# EAGLE design robot (EAGLE 7.5.0)
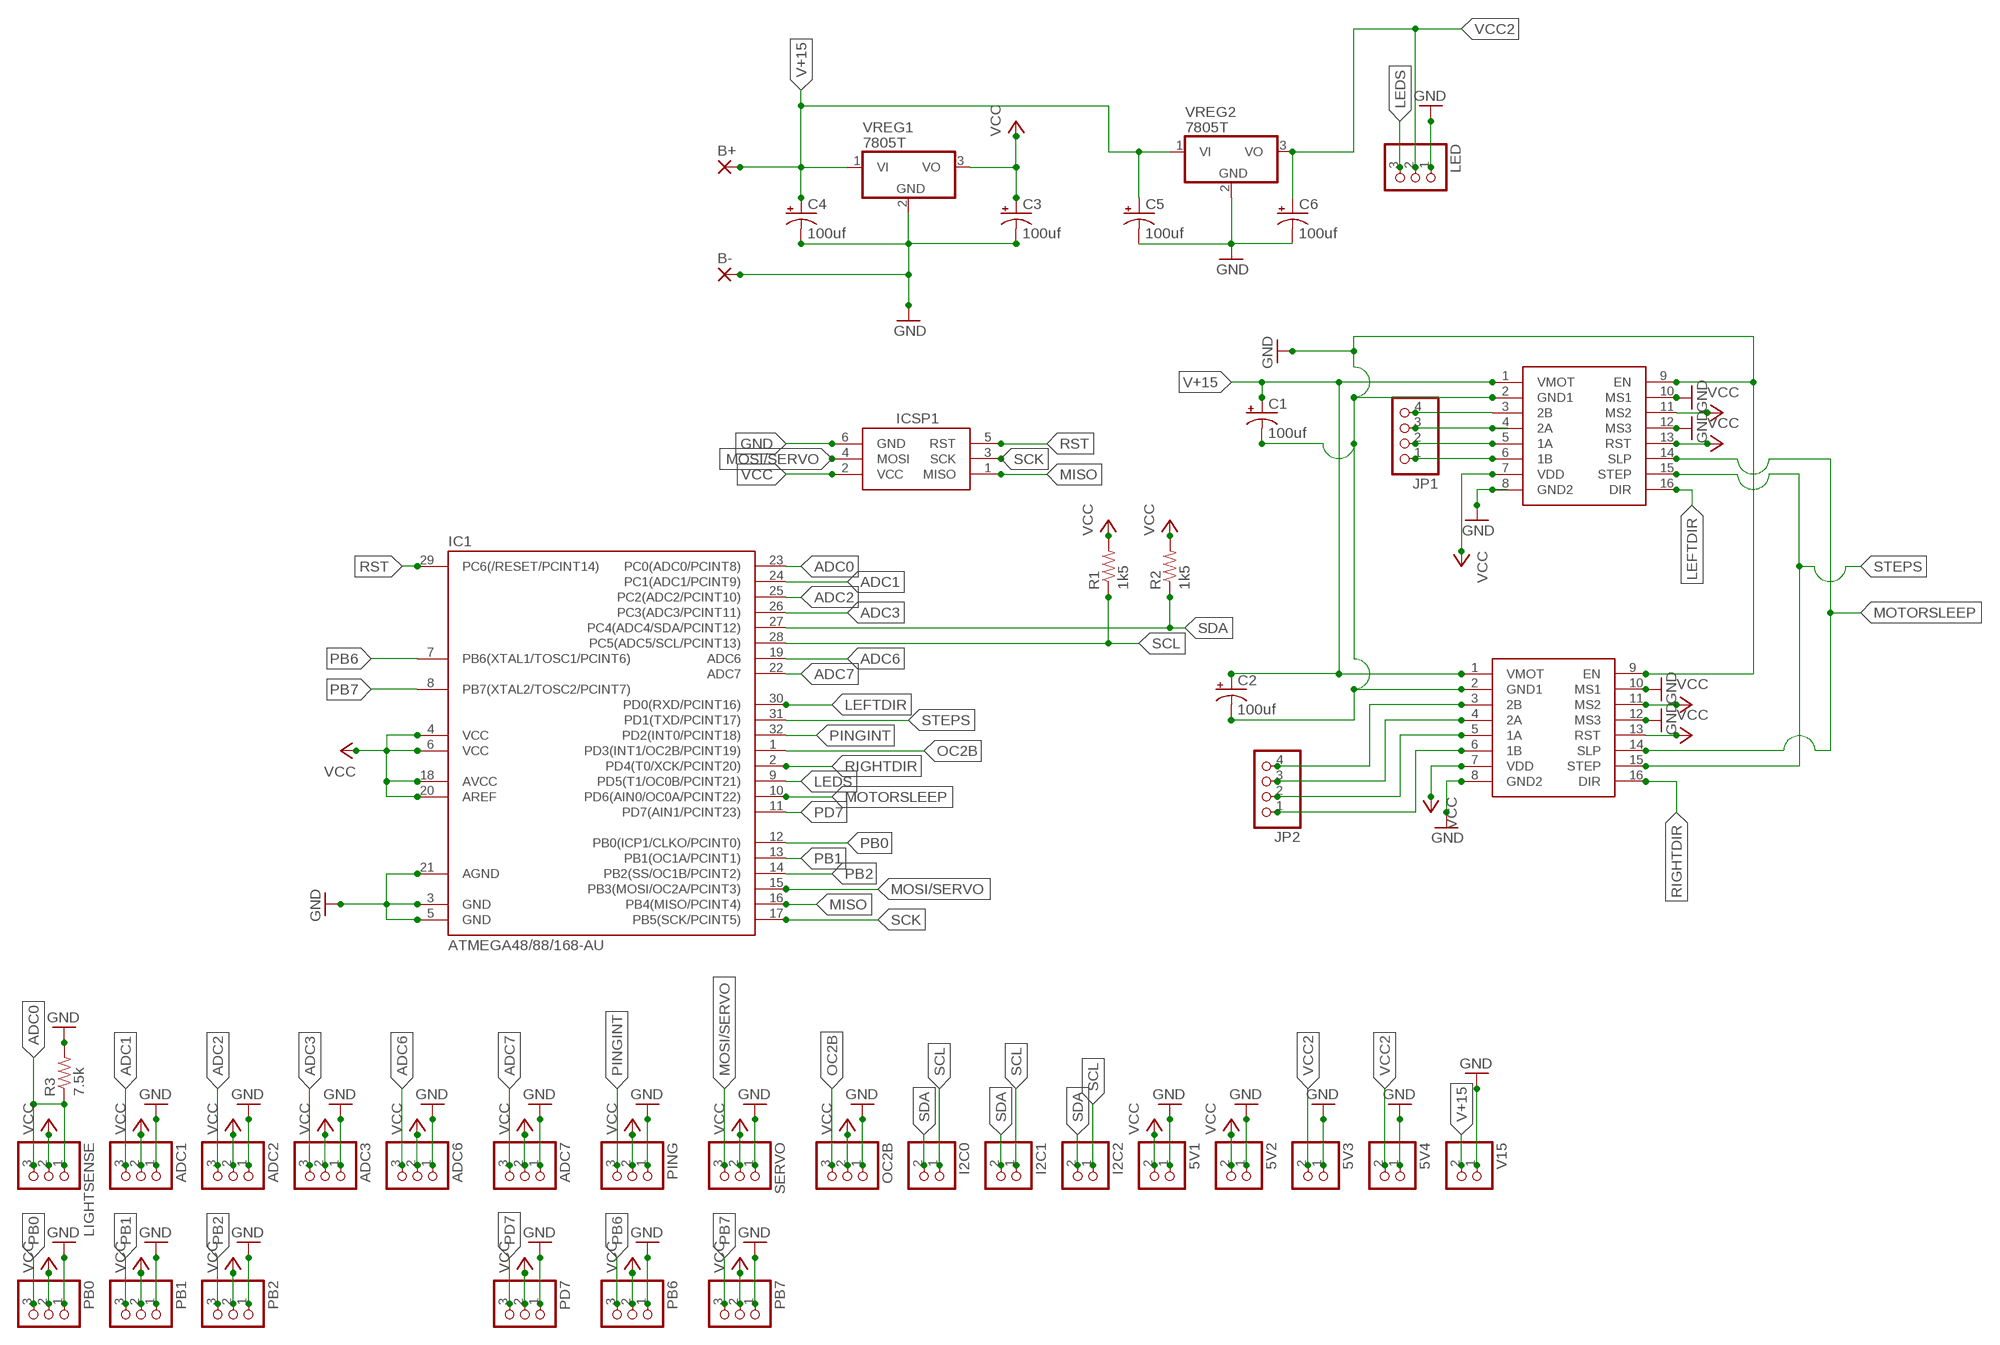
[diagram p0: schematic, sheet 1]

## Parts
5V1  PINHD-1X2  [1X02]
5V2  PINHD-1X2  [1X02]
5V3  PINHD-1X2  [1X02]
5V4  PINHD-1X2  [1X02]
ADC1  PINHD-1X3  [1X03]
ADC2  PINHD-1X3  [1X03]
ADC3  PINHD-1X3  [1X03]
ADC6  PINHD-1X3  [1X03]
ADC7  PINHD-1X3  [1X03]
B+  3,81/1,4  [3,81/1,4]
B-  3,81/1,4  [3,81/1,4]
C1  100uf  CPOL-USE3.5-8  [E3,5-8]
C2  100uf  CPOL-USE3.5-8  [E3,5-8]
C3  100uf  CPOL-USE3.5-8  [E3,5-8]
C4  100uf  CPOL-USE3.5-8  [E3,5-8]
C5  100uf  CPOL-USE3.5-8  [E3,5-8]
C6  100uf  CPOL-USE3.5-8  [E3,5-8]
I2C0  PINHD-1X2  [1X02]
I2C1  PINHD-1X2  [1X02]
I2C2  PINHD-1X2  [1X02]
IC1  ATMEGA48/88/168-AU  [TQFP32-08]
ICSP1  AVRISP-6  [AVRISP]
JP1  PINHD-1X4  [1X04]
JP2  PINHD-1X4  [1X04]
LED  PINHD-1X3  [1X03]
LEFTSTEPPER  POLOLUESTEPPERDRIVER  [DIL16]
LIGHTSENSE  PINHD-1X3  [1X03]
OC2B  PINHD-1X3  [1X03]
PB0  PINHD-1X3  [1X03]
PB1  PINHD-1X3  [1X03]
PB2  PINHD-1X3  [1X03]
PB6  PINHD-1X3  [1X03]
PB7  PINHD-1X3  [1X03]
PD7  PINHD-1X3  [1X03]
PING  PINHD-1X3  [1X03]
R1  1k5  R-US_M1206  [M1206]
R2  1k5  R-US_M1206  [M1206]
R3  7.5k  R-US_0309/10  [0309/10]
RIGHTSTEPPER  POLOLUESTEPPERDRIVER  [DIL16]
SERVO  PINHD-1X3  [1X03]
V15  PINHD-1X2  [1X02]
VREG1  7805T  [TO220H]
VREG2  7805T  [TO220H]

## Nets
1-1A: JP1.2 LEFTSTEPPER.5(1A)
1-1B: JP1.1 LEFTSTEPPER.6(1B)
1-2A: JP1.3 LEFTSTEPPER.4(2A)
1-2B: JP1.4 LEFTSTEPPER.3(2B)
2-1A: JP2.2 RIGHTSTEPPER.5(1A)
2-1B: JP2.1 RIGHTSTEPPER.6(1B)
2-2A: JP2.3 RIGHTSTEPPER.4(2A)
2-2B: JP2.4 RIGHTSTEPPER.3(2B)
ADC0: IC1.23(PC0(ADC0/PCINT8)) LIGHTSENSE.1 LIGHTSENSE.3 R3.1
ADC1: ADC1.3 IC1.24(PC1(ADC1/PCINT9))
ADC2: ADC2.3 IC1.25(PC2(ADC2/PCINT10))
ADC3: ADC3.3 IC1.26(PC3(ADC3/PCINT11))
ADC6: ADC6.3 IC1.19(ADC6)
ADC7: ADC7.3 IC1.22(ADC7)
GND: 5V1.1 5V2.1 5V3.1 5V4.1 ADC1.1 ADC2.1 ADC3.1 ADC6.1 ADC7.1 B-.1(P) C1.- C2.- C3.- C4.- C5.- C6.- IC1.3(GND) IC1.5(GND) IC1.21(AGND) ICSP1.6(GND) LED.1 LEFTSTEPPER.2(GND1) LEFTSTEPPER.8(GND2) LEFTSTEPPER.9(EN) LEFTSTEPPER.10(MS1) LEFTSTEPPER.12(MS3) OC2B.1 PB0.1 PB1.1 PB2.1 PB6.1 PB7.1 PD7.1 PING.1 R3.2 RIGHTSTEPPER.2(GND1) RIGHTSTEPPER.8(GND2) RIGHTSTEPPER.9(EN) RIGHTSTEPPER.10(MS1) RIGHTSTEPPER.12(MS3) SERVO.1 V15.1 VREG1.2(GND) VREG2.2(GND)
LEDS: IC1.9(PD5(T1/OC0B/PCINT21)) LED.3
LEFTDIR: IC1.30(PD0(RXD/PCINT16)) LEFTSTEPPER.16(DIR)
MISO: IC1.16(PB4(MISO/PCINT4)) ICSP1.1(MISO)
MOSI/SERVO: IC1.15(PB3(MOSI/OC2A/PCINT3)) ICSP1.4(MOSI) SERVO.3
MOTORSLEEP: IC1.10(PD6(AIN0/OC0A/PCINT22)) LEFTSTEPPER.14(SLP) RIGHTSTEPPER.14(SLP)
OC2B: IC1.1(PD3(INT1/OC2B/PCINT19)) OC2B.3
PB0: IC1.12(PB0(ICP1/CLKO/PCINT0)) PB0.3
PB1: IC1.13(PB1(OC1A/PCINT1)) PB1.3
PB2: IC1.14(PB2(SS/OC1B/PCINT2)) PB2.3
PB6: IC1.7(PB6(XTAL1/TOSC1/PCINT6)) PB6.3
PB7: IC1.8(PB7(XTAL2/TOSC2/PCINT7)) PB7.3
PD7: IC1.11(PD7(AIN1/PCINT23)) PD7.3
PINGINT: IC1.32(PD2(INT0/PCINT18)) PING.3
RIGHTDIR: IC1.2(PD4(T0/XCK/PCINT20)) RIGHTSTEPPER.16(DIR)
RST: IC1.29(PC6(/RESET/PCINT14)) ICSP1.5(RST)
SCK: IC1.17(PB5(SCK/PCINT5)) ICSP1.3(SCK)
SCL: I2C0.1 I2C1.1 I2C2.1 IC1.28(PC5(ADC5/SCL/PCINT13)) R1.1
SDA: I2C0.2 I2C1.2 I2C2.2 IC1.27(PC4(ADC4/SDA/PCINT12)) R2.1
STEPS: IC1.31(PD1(TXD/PCINT17)) LEFTSTEPPER.15(STEP) RIGHTSTEPPER.15(STEP)
V+15: B+.1(P) C1.+ C2.+ C4.+ C5.+ LEFTSTEPPER.1(VMOT) RIGHTSTEPPER.1(VMOT) V15.2 VREG1.1(VI) VREG2.1(VI)
VCC: 5V1.2 5V2.2 ADC1.2 ADC2.2 ADC3.2 ADC6.2 ADC7.2 C3.+ IC1.4(VCC) IC1.6(VCC) IC1.18(AVCC) IC1.20(AREF) ICSP1.2(VCC) LEFTSTEPPER.7(VDD) LEFTSTEPPER.11(MS2) LEFTSTEPPER.13(RST) LIGHTSENSE.2 OC2B.2 PB0.2 PB1.2 PB2.2 PB6.2 PB7.2 PD7.2 PING.2 R1.2 R2.2 RIGHTSTEPPER.7(VDD) RIGHTSTEPPER.11(MS2) RIGHTSTEPPER.13(RST) SERVO.2 VREG1.3(VO)
VCC2: 5V3.2 5V4.2 C6.+ LED.2 VREG2.3(VO)

## Library data of the parts
5V1-5V4 I2C0 I2C1 I2C2 V15 = pinhead:PINHD-1X2: PIN HEADER
ADC1-ADC3 ADC6 ADC7 LED LIGHTSENSE OC2B PB0 PB1 PB2 PB6 PB7 PD7 PING SERVO = pinhead:PINHD-1X3: PIN HEADER
B+ B- = wirepad:3,81/1,4: THROUGH-HOLE PAD
C1-C6 = rcl:CPOL-US: POLARIZED CAPACITOR, American symbol
IC1 = atmega8:ATMEGA48/88/168
ICSP1 = adafruit:AVRISP: AVR ISP HEADER Standard 6 pin header for AVR programming
JP1 JP2 = pinhead:PINHD-1X4: PIN HEADER
LEFTSTEPPER RIGHTSTEPPER = reprap:POLOLUESTEPPERDRIVER: Pololu stepper driver based on the A4983.
R1-R3 = resistor:R-US_: RESISTOR, American symbol
VREG1 VREG2 = linear:78*: Positive VOLTAGE REGULATOR Source: http://cache.national.com/ds/LM/LM78L05.pdf http://www.fairchildsemi.com/ds/LM/LM7805.pdf

## Net classes
0 default: clearance 0.205 mm

## Board
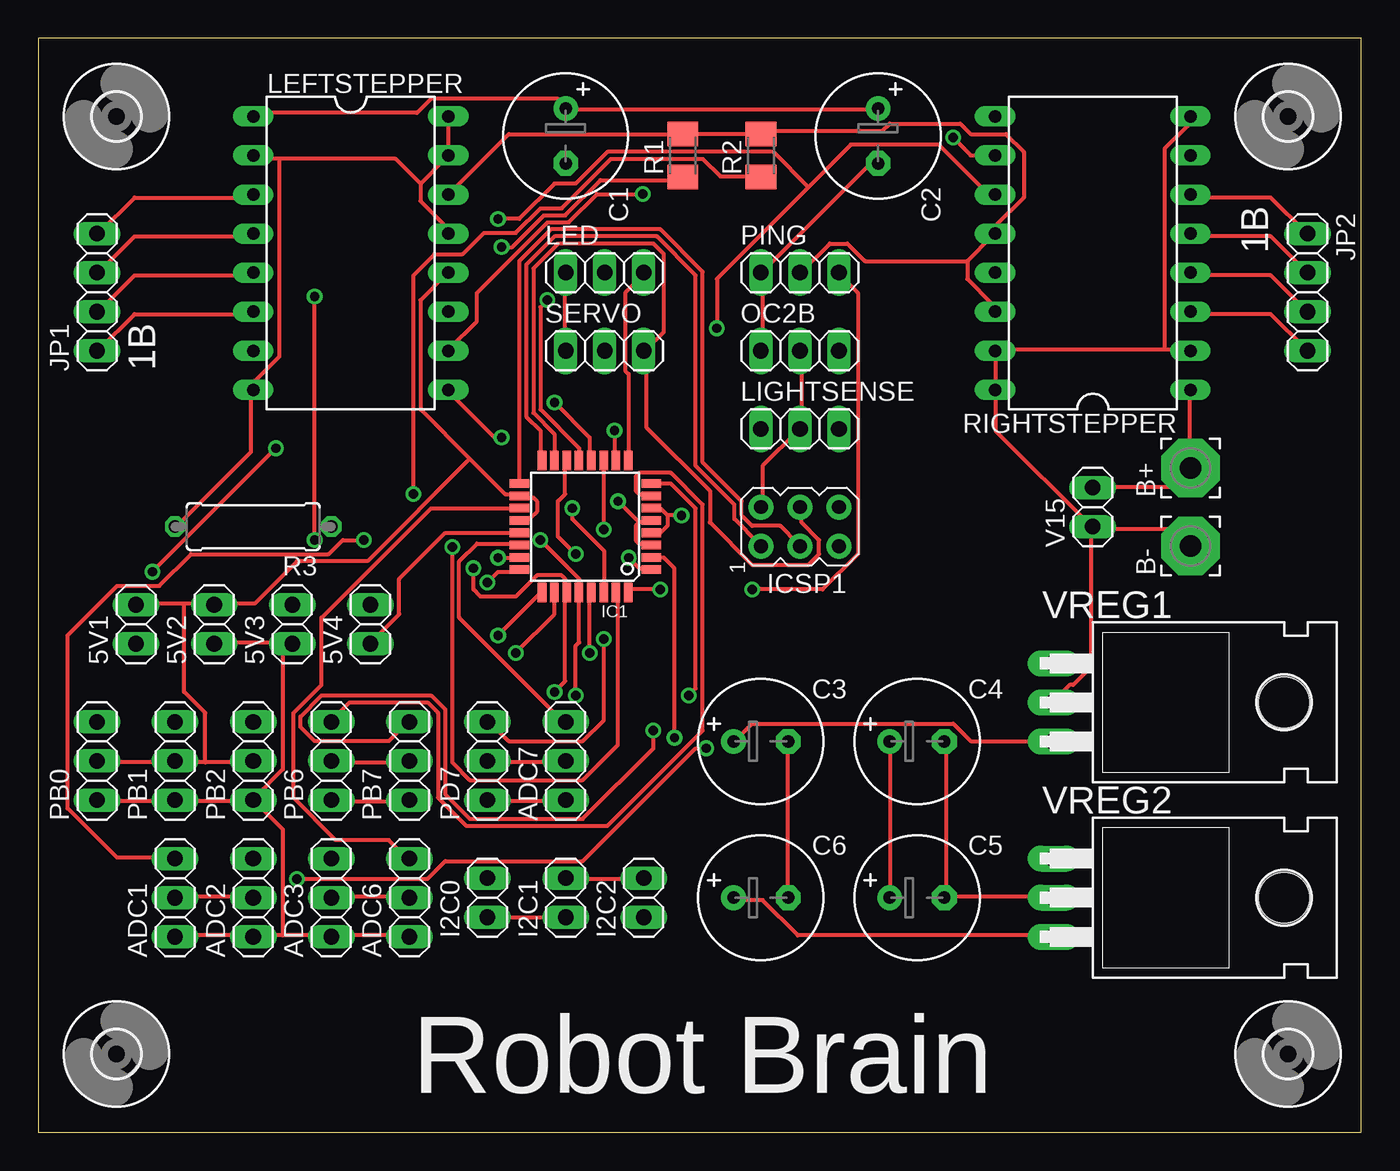
[diagram p1: board, top side]
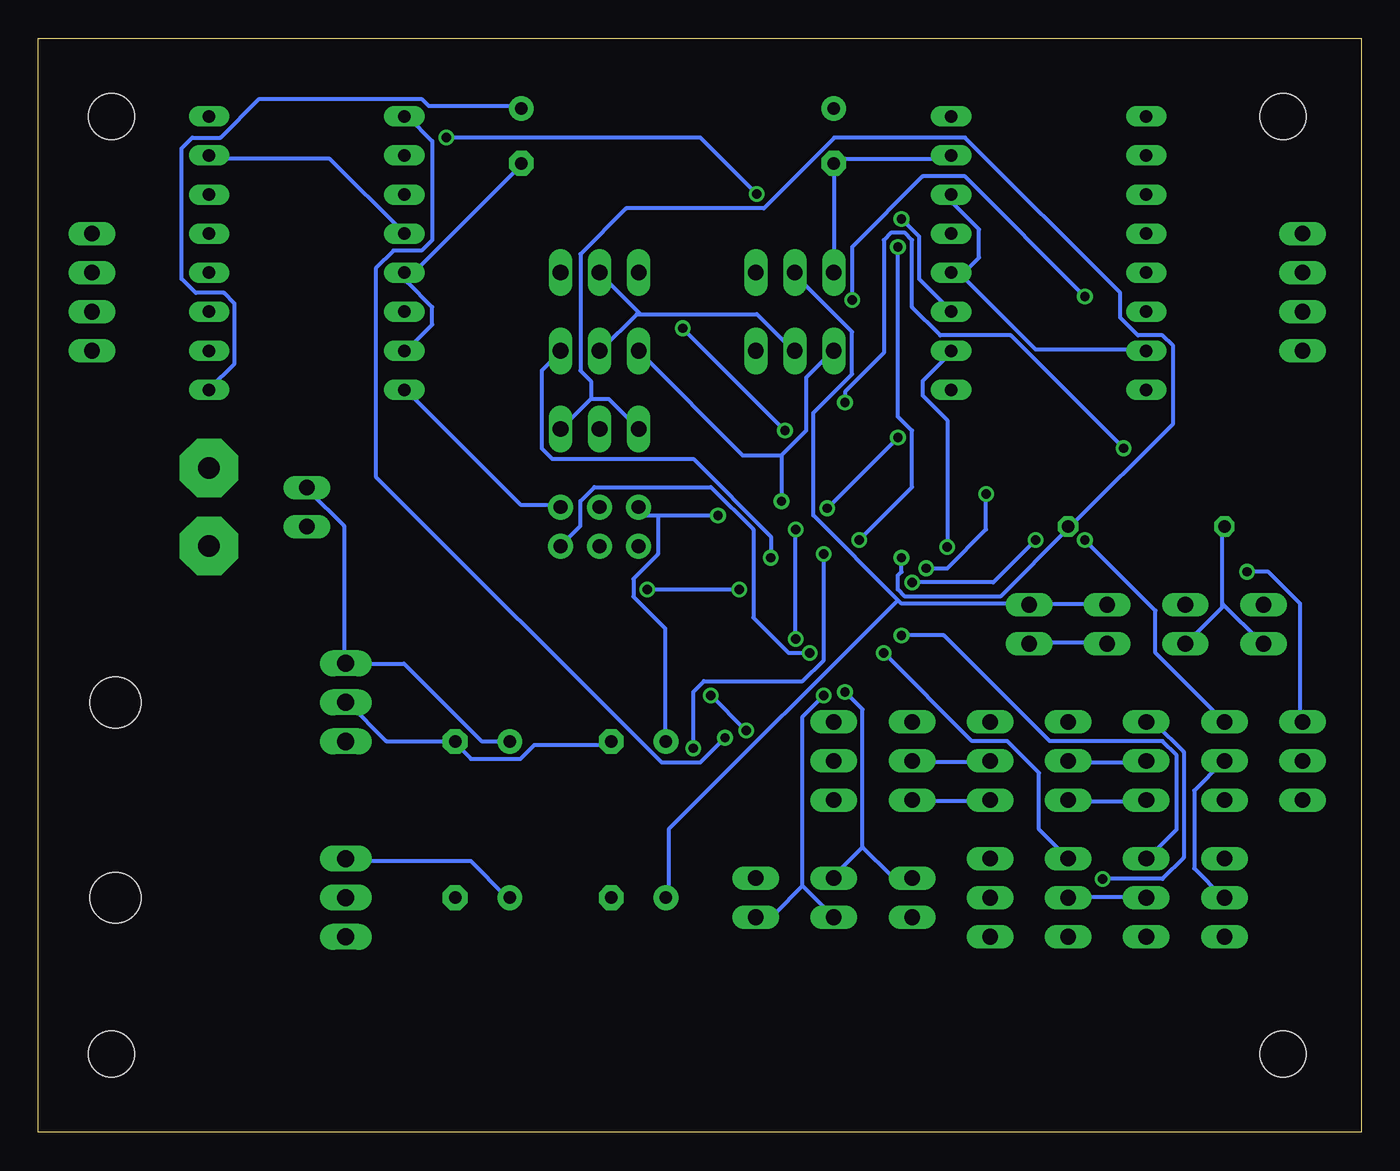
[diagram p2: board, bottom side, seen from below]

Size 86.03 x 71.11 mm. Coordinates in mm from the lower left corner, seen from the top.
Outline: 0,0 86.03,0 86.03,71.11 0,71.11 0,0
Copper layers (1*16): Top 0.035mm / dielectric 1.5mm / Bottom 0.035mm
Design rules "default": minimum track width 10mil, minimum drill 24mil, track to track 8mil, track to pad 8mil, pad to pad 8mil, via to via 8mil, smd to smd 8mil, copper to edge 40mil, drill to drill 8mil, minimum pad ring 10mil, minimum via ring 8mil, stop-mask expansion 4mil, vias tented up to drill 0mil, thermal gap 10mil

### Footprints (pad centres in the part's own frame; a part is rotated, then mirrored left to right if it is on the bottom)
1X02 = drill 1.016 long: 1 -1.27,0; 2 1.27,0
1X03 = drill 1.016 long: 1 -2.54,0; 2 0,0; 3 2.54,0
3,81/1,4 = drill 1.397 pad 3.81 octagon: 1 0,0
E3,5-8 = drill 0.813 pad 1.6: + -1.778,0 | drill 0.813 pad 1.6 octagon: - 1.778,0
TQFP32-08 = smd 1.27 x 0.559: 1 -4.293,2.8; 2 -4.293,2; 3 -4.293,1.2; 4 -4.293,0.4; 5 -4.293,-0.4; 6 -4.293,-1.2; 7 -4.293,-2; 8 -4.293,-2.8; 17 4.293,-2.8; 18 4.293,-2; 19 4.293,-1.2; 20 4.293,-0.4; 21 4.293,0.4; 22 4.293,1.2; 23 4.293,2; 24 4.293,2.8 | smd 0.559 x 1.27: 9 -2.8,-4.293; 10 -2,-4.293; 11 -1.2,-4.293; 12 -0.4,-4.293; 13 0.4,-4.293; 14 1.2,-4.293; 15 2,-4.293; 16 2.8,-4.293; 25 2.8,4.293; 26 2,4.293; 27 1.2,4.293; 28 0.4,4.293; 29 -0.4,4.293; 30 -1.2,4.293; 31 -2,4.293; 32 -2.8,4.293
AVRISP = drill 0.9 pad 1.626: 1 -1.27,2.54; 2 1.27,2.54; 3 -1.27,0; 4 1.27,0; 5 -1.27,-2.54; 6 1.27,-2.54
1X04 = drill 1.016 long: 1 -3.81,0; 2 -1.27,0; 3 1.27,0; 4 3.81,0
DIL16 = drill 0.813 long: 1 -17.78,8.89; 2 -17.78,6.35; 3 -17.78,3.81; 4 -17.78,1.27; 5 -17.78,-1.27; 6 -17.78,-3.81; 7 -17.78,-6.35; 8 -17.78,-8.89; 9 -5.08,8.89; 10 -5.08,6.35; 11 -5.08,3.81; 12 -5.08,1.27; 13 -5.08,-1.27; 14 -5.08,-3.81; 15 -5.08,-6.35; 16 -5.08,-8.89
M1206 = smd 1.6 x 2: 1 -1.4,0; 2 1.4,0
0309/10 = drill 0.813 octagon: 1 -5.08,0; 2 5.08,0
3,0 = hole 3: 0,0
TO220H = drill 1.118 long: 1 -2.54,-10.16; 2 0,-10.16; 3 2.54,-10.16 | hole 3.302: 0,4.826

### Placement (x,y rotation side)
5V1  6.35,33.02 90 top
5V2  11.43,33.02 90 top
5V3  16.51,33.02 90 top
5V4  21.59,33.02 90 top
ADC1  8.89,15.24 90 top
ADC2  13.97,15.24 90 top
ADC3  19.05,15.24 90 top
ADC6  24.13,15.24 90 top
ADC7  34.29,24.13 90 top
B+  74.93,43.18 90 top
B-  74.93,38.1 90 top
C1  34.29,64.77 270 top
C2  54.61,64.77 270 top
C3  46.99,25.4 0 top
C4  57.15,25.4 0 top
C5  57.15,15.24 0 top
C6  46.99,15.24 0 top
I2C0  29.21,15.24 90 top
I2C1  34.29,15.24 90 top
I2C2  39.37,15.24 90 top
IC1  35.56,39.37 180 top
ICSP1  49.53,39.37 90 top
JP1  3.81,54.61 90 top
JP2  82.55,54.61 270 top
LED  36.83,55.88 0 top
LEFTSTEPPER  31.75,57.15 0 top
LIGHTSENSE  49.53,45.72 0 top
OC2B  49.53,50.8 0 top
PB0  3.81,24.13 90 top
PB1  8.89,24.13 90 top
PB2  13.97,24.13 90 top
PB6  19.05,24.13 90 top
PB7  24.13,24.13 90 top
PD7  29.21,24.13 90 top
PING  49.53,55.88 0 top
R1  41.91,63.5 90 top
R2  46.99,63.5 90 top
R3  13.97,39.37 180 top
RIGHTSTEPPER  57.15,57.15 180 top
SERVO  36.83,50.8 0 top
U$1  [3,0]  81.28,5.08 0 top
U$2  [3,0]  5.08,5.08 0 top
U$3  [3,0]  5.08,66.04 0 top
U$4  [3,0]  81.28,66.04 0 top
V15  68.58,40.64 90 top
VREG1  76.2,27.94 270 top
VREG2  76.2,15.24 270 top

### Tracks (layer width: path | path; a pad name or v marks a point on that pad's centre or on a via)
1-1A
  Top 0.254: LEFTSTEPPER.5 13.83,55.71 6.26,55.71 3.96,53.41 JP1.2
1-1B
  Top 0.254: LEFTSTEPPER.6 13.83,53.18 6.26,53.18 3.96,50.89 JP1.1
1-2A
  Top 0.254: LEFTSTEPPER.4 13.83,58.23 6.26,58.23 3.96,55.94 JP1.3
1-2B
  Top 0.254: LEFTSTEPPER.3 13.83,60.76 6.26,60.76 3.96,58.46 JP1.4
2-1A
  Top 0.254: RIGHTSTEPPER.5 75.11,58.23 80.16,58.23 82.45,55.94 JP2.2
2-1B
  Top 0.254: RIGHTSTEPPER.6 75.11,60.76 80.16,60.76 82.45,58.46 JP2.1
2-2A
  Top 0.254: RIGHTSTEPPER.4 75.11,55.71 80.16,55.71 82.45,53.41 JP2.3
2-2B
  Top 0.254: RIGHTSTEPPER.3 75.11,53.18 80.16,53.18 82.45,50.89 JP2.4
ADC0  (via drill 0.61)
  Top 0.254: v29.89,37.35 31.04,37.35 IC1.23
  Bottom 0.254: 50.09,47.67 48.94,47.67 47.11,45.84 LIGHTSENSE.1 | 50.09,47.67 51.93,45.84 LIGHTSENSE.3 | v29.89,37.35 29.89,36.43 30.12,36.2 30.12,35.28 29.67,34.82 23.47,34.82 19.11,39.18 R3.1 18.88,39.41 12.22,46.07 12.22,51.12 12.91,51.81 14.52,51.81 15.67,52.95 15.67,54.56 25.76,64.66 34.26,64.66 38.85,60.07 47.8,60.07 50.78,57.09 50.78,49.51 50.09,48.82 50.09,47.67
ADC1  (via drill 0.61)
  Top 0.254: v29.21,35.74 29.89,36.43 31.04,36.43 IC1.24 | v21.17,38.5 19.8,38.5 18.88,37.58 9.93,37.58 7.86,35.51 5.11,35.51 1.9,32.3 1.9,21.05 5.11,17.84 8.78,17.84 ADC1.3
  Bottom 0.254: v29.21,35.74 23.93,35.74 v21.17,38.5
ADC2  (via drill 0.61)
  Top 0.254: v29.89,32.3 32.65,35.05 IC1.25
  Bottom 0.254: v29.89,32.3 27.14,32.3 20.26,25.41 12.91,25.41 11.99,24.5 11.99,19.68 13.83,17.84 ADC2.3
ADC3  (via drill 0.61)
  Top 0.254: v31.04,31.15 33.57,33.68 33.57,35.05 IC1.26
  Bottom 0.254: v31.04,31.15 25.31,25.41 23.01,25.41 20.95,23.35 20.95,19.68 19.11,17.84 ADC3.3
ADC6
  Top 0.254: IC1.19 31.04,40.56 25.53,40.56 18.42,33.45 18.42,29.09 16.58,27.25 16.58,21.74 19.34,18.99 22.78,18.99 23.93,17.84 ADC6.3
ADC7
  Top 0.254: IC1.22 31.04,38.27 28.52,38.27 27.37,37.12 27.37,33.45 34.26,26.56 ADC7.3
GND  (via drill 0.61)
  Top 0.254: ADC1.1 9.01,12.79 13.83,12.79 ADC2.1 14.06,12.79 15.9,12.79 | ADC6.1 23.93,12.79 19.11,12.79 ADC3.1 18.88,12.79 15.9,12.79 | PD7.1 29.44,21.51 34.26,21.51 ADC7.1 | PB0.1 3.96,21.51 8.78,21.51 PB1.1 9.01,21.51 13.83,21.51 PB2.1 | PB7.1 23.93,21.51 19.11,21.51 PB6.1 | 15.9,12.79 15.9,19.68 14.06,21.51 PB2.1 | IC1.21 31.04,38.95 26.45,38.95 23.47,35.97 23.47,33.68 21.63,31.84 5V4.1 | R3.2 9.01,39.41 13.83,44.23 13.83,48.13 LEFTSTEPPER.8 14.06,48.36 14.06,48.82 15.67,50.43 15.67,63.28 | 15.9,31.84 11.54,31.84 5V2.1 | 15.9,31.84 16.36,31.84 5V3.1 15.9,31.84 | 15.9,31.84 15.9,23.58 14.06,21.74 PB2.1 | 24.85,61.67 24.85,60.53 26.45,58.92 26.45,58.46 LEFTSTEPPER.12 | 24.85,61.67 26.45,63.28 LEFTSTEPPER.10 26.68,63.51 26.68,66.03 LEFTSTEPPER.9 | 15.67,63.28 23.24,63.28 24.85,61.67 | 15.67,63.28 14.06,63.28 LEFTSTEPPER.2 | 39.08,39.64 38.85,39.41 38.85,38.5 39.08,38.27 39.76,38.27 IC1.3 | 39.08,39.64 39.76,39.64 IC1.5 | v37.7,41.02 39.08,39.64 | LED.1 34.26,55.71 34.26,50.89 SERVO.1 | C6.- 48.71,15.32 48.71,25.18 C3.- | 59.04,15.32 65.93,15.32 VREG2.2 | 59.04,15.32 59.04,25.18 C4.- | 59.04,15.32 C5.- | OC2B.1 47.11,50.89 47.11,55.71 PING.1 47.11,55.94 53.99,62.82 54.45,62.82 C2.- | V15.1 68.68,39.18 73.96,39.18 74.88,38.27 B-.1 | 73.27,50.89 62.25,50.89 RIGHTSTEPPER.10 62.25,50.66 62.25,48.36 RIGHTSTEPPER.9 62.25,48.13 62.25,45.61 68.45,39.41 V15.1 | 73.27,50.89 74.88,50.89 RIGHTSTEPPER.2 | 73.27,50.89 73.27,63.97 74.88,65.58 74.88,66.03 RIGHTSTEPPER.8 | VREG1.2 66.16,28.17 67.08,29.09 67.3,29.09 68.45,30.23 68.45,39.18 V15.1
  Bottom 0.254: PB2.1 14.06,21.51 18.88,21.51 PB6.1 | PD7.1 29.21,21.51 24.16,21.51 PB7.1 | 5V3.1 16.58,31.84 21.4,31.84 5V4.1 | 9.01,34.36 9.01,34.14 11.31,31.84 5V2.1 | 9.01,34.36 9.01,39.18 R3.2 | 9.01,34.36 6.49,31.84 5V1.1 | 37.7,44 v37.7,41.02 | 37.7,44 36.09,45.61 36.09,49.05 34.49,50.66 SERVO.1 | LED.1 34.26,55.94 34.26,62.82 C1.- 34.26,63.05 34.03,63.28 26.68,63.28 LEFTSTEPPER.10 | VREG1.2 65.93,27.94 63.4,25.41 59.04,25.41 C4.- 58.81,25.18 57.89,24.27 54.68,24.27 53.76,25.18 48.94,25.18 C3.- | 62.03,55.48 62.03,55.25 60.42,53.64 60.42,52.49 62.03,50.89 RIGHTSTEPPER.10 | 62.03,55.48 62.03,55.71 RIGHTSTEPPER.12 62.03,55.48 | ICSP1.6 52.16,40.79 54.68,40.79 62.03,48.13 RIGHTSTEPPER.9 | 62.03,55.48 54.68,62.82 C2.- | 37.7,44 40.22,44 46.88,50.66 OC2B.1
LEDS
  Top 0.254: IC1.9 38.39,43.77 38.39,49.28 38.16,49.51 38.16,54.56 39.3,55.71 LED.3
LEFTDIR  (via drill 0.61)
  Top 0.254: v34.71,40.56 34.71,39.87 36.78,37.81 36.78,35.28 IC1.30 | v30.12,45.15 29.67,45.15 26.68,48.13 LEFTSTEPPER.16
  Bottom 0.254: v30.12,45.15 v34.71,40.56
MISO
  Top 0.254: IC1.16 32.65,43.77 32.65,45.61 31.73,46.53 31.73,56.4 33.57,58.23 40.22,58.23 42.75,55.71 42.75,43.31 45.27,40.79 45.27,39.87 46.88,38.27 ICSP1.1
MOSI/SERVO
  Top 0.254: IC1.15 33.57,43.77 33.57,45.38 32.19,46.76 32.19,56.17 33.8,57.77 39.99,57.77 40.68,57.09 40.68,52.04 39.53,50.89 SERVO.3 39.53,50.66 39.53,45.84 43.67,41.71 43.67,39.64 46.42,36.89 50.09,36.89 50.78,37.58 50.78,38.5 49.63,39.64 49.63,40.56 ICSP1.4
MOTORSLEEP  (via drill 0.61)
  Top 0.254: v37.47,45.61 37.47,43.77 IC1.10 | v44.12,52.27 44.12,55.48 50.09,61.45 | 50.09,61.45 52.85,64.2 58.58,64.2 62.03,60.76 RIGHTSTEPPER.14 | v29.89,59.38 31.27,59.38 33.57,61.67 34.94,61.67 37.01,63.74 47.8,63.74 50.09,61.45
  Bottom 0.254: v44.12,52.27 v37.47,45.61 | v29.89,59.38 28.75,58.23 28.75,55.48 26.68,53.41 LEFTSTEPPER.14
OC2B  (via drill 0.61)
  Top 0.254: v38.39,37.35 39.08,36.66 39.76,36.66 IC1.1
  Bottom 0.254: v38.39,37.35 38.39,38.73 43.44,43.77 52.62,43.77 53.3,44.46 53.3,49.51 52.16,50.66 OC2B.3
PB0  (via drill 0.61)
  Top 0.254: v33.57,47.45 35.86,45.15 35.86,43.77 IC1.12 | v7.4,36.43 v15.44,44.46
  Bottom 0.254: v33.57,47.45 33.57,48.13 31.04,50.66 31.04,58 30.58,58.46 29.67,58.46 29.21,58 29.21,53.64 27.37,51.81 22.78,51.81 v15.44,44.46 | v7.4,36.43 6.03,36.43 3.96,34.36 3.96,26.79 PB0.3
PB1  (via drill 0.61)
  Top 0.254: v33.11,54.1 32.65,53.64 32.65,46.99 35.17,44.46 35.17,43.77 IC1.13 | v17.96,38.5 v17.96,54.33
  Bottom 0.254: v33.11,54.1 33.11,57.54 28.52,62.13 25.76,62.13 v17.96,54.33 | v17.96,38.5 13.37,33.91 13.37,31.15 PB1.3
PB2  (via drill 0.61)
  Top 0.254: v34.94,37.58 33.8,38.73 33.8,41.02 34.26,41.48 34.26,43.54 IC1.14 | v43.44,24.96 42.75,24.96 35.4,17.61 26.45,17.61 25.31,16.46 v16.81,16.46
  Bottom 0.254: v34.94,37.58 34.94,30.69 36.32,29.32 42.75,29.32 43.44,28.63 v43.44,24.96 | v16.81,16.46 12.91,16.46 11.54,17.84 11.54,24.73 13.37,26.56 13.83,26.56 PB2.3
PB6
  Top 0.254: IC1.7 39.76,41.48 39.08,41.48 38.85,41.71 38.85,42.63 39.08,42.86 41.14,42.86 43.21,40.79 43.21,26.1 37.01,19.91 27.83,19.91 25.99,21.74 25.99,27.25 25.31,27.94 20.26,27.94 19.11,26.79 PB6.3
PB7  (via drill 0.61)
  Top 0.254: v42.29,28.4 42.75,28.86 42.75,40.56 41.14,42.17 39.99,42.17 IC1.8 | v39.99,26.1 39.99,24.96 35.4,20.37 28.06,20.37 26.45,21.97 26.45,27.48 25.53,28.4 18.42,28.4 17.04,27.02 17.04,26.33 17.96,25.41 22.78,25.41 23.93,26.56 PB7.3
  Bottom 0.254: v39.99,26.1 v42.29,28.4
PD7  (via drill 0.61)
  Top 0.254: v36.78,39.18 36.78,43.54 IC1.11 | v36.78,32.07 36.78,26.79 35.4,25.41 30.58,25.41 29.44,26.56 PD7.3
  Bottom 0.254: v36.78,32.07 v36.78,39.18
PINGINT  (via drill 0.61)
  Top 0.254: v40.45,35.28 38.39,35.28 IC1.32 | v46.42,35.28 51.01,35.28 53.3,37.58 53.3,54.56 52.16,55.71 PING.3
  Bottom 0.254: v46.42,35.28 v40.45,35.28
RIGHTDIR  (via drill 0.61)
  Top 0.254: v41.37,25.64 41.37,36.66 40.68,37.35 39.99,37.35 IC1.2
  Bottom 0.254: v41.37,25.64 42.98,24.04 45.5,24.04 64.09,42.63 64.09,56.17 62.94,57.31 61.11,57.31 60.42,58 60.42,64.43 62.03,66.03 RIGHTSTEPPER.16
RST  (via drill 0.61)
  Top 0.254: v35.86,31.15 35.86,35.05 IC1.29
  Bottom 0.254: v35.86,31.15 37.24,31.15 39.53,33.45 39.53,39.18 42.29,41.94 49.86,41.94 50.78,41.02 50.78,39.41 51.93,38.27 ICSP1.5
SCK
  Top 0.254: IC1.17 31.27,42.4 31.27,56.63 33.34,58.69 40.45,58.69 43.21,55.94 43.21,43.54 45.73,41.02 45.73,40.1 46.42,39.41 48.26,39.41 49.4,38.27 ICSP1.3
SCL  (via drill 0.61)
  Top 0.254: v34.94,28.4 34.94,31.61 35.17,31.84 35.17,35.05 IC1.28 35.17,35.28 35.17,35.97 v32.65,38.5 | v30.12,57.54 30.81,57.54 32.88,59.61 34.26,59.61 36.55,61.9 41.83,61.9 R1.1 | I2C0.1 29.44,13.94 34.26,13.94 I2C1.1
  Bottom 0.254: v34.94,28.4 36.32,27.02 36.32,16 | 36.32,16 34.49,14.17 I2C1.1 | v30.12,57.54 30.12,46.53 29.21,45.61 29.21,41.94 v32.65,38.5 | 36.32,16 38.16,14.17 39.3,14.17 I2C2.1
SDA  (via drill 0.61)
  Top 0.254: v33.57,28.63 34.26,29.32 34.26,35.05 IC1.27 34.26,35.28 34.26,35.97 34.03,36.2 32.42,36.2 31.04,34.82 28.75,34.82 28.29,35.28 v28.29,36.66 | v24.39,41.48 24.39,55.71 25.76,57.09 27.6,57.09 28.98,58.46 31.04,58.46 32.65,60.07 34.03,60.07 37.24,63.28 43.21,63.28 44.35,62.13 46.88,62.13 R2.1 | I2C2.2 39.3,16.46 34.49,16.46 I2C1.2
  Bottom 0.254: v33.57,28.63 32.42,27.48 32.42,18.53 | 32.42,18.53 34.26,16.69 I2C1.2 | v24.39,41.48 24.39,39.18 26.91,36.66 v28.29,36.66 | 32.42,18.53 30.58,16.69 29.44,16.69 I2C0.2
STEPS  (via drill 0.61)
  Top 0.254: v26.91,38.04 26.91,24.04 28.06,22.89 35.4,22.89 37.7,25.18 37.7,35.05 IC1.31 | v59.5,64.66 60.65,63.51 62.03,63.51 RIGHTSTEPPER.15 | v39.3,60.99 36.32,60.99 34.49,59.15 33.11,59.15 28.52,54.56 28.52,52.72 26.68,50.89 LEFTSTEPPER.15
  Bottom 0.254: v26.91,38.04 26.91,46.3 28.52,47.91 28.52,48.82 26.68,50.66 LEFTSTEPPER.15 | v59.5,64.66 42.98,64.66 v39.3,60.99
V+15
  Top 0.254: LEFTSTEPPER.1 14.06,66.27 24.62,66.27 25.53,67.18 33.8,67.18 34.26,66.72 C1.+ 34.49,66.5 54.45,66.5 C2.+ | C5.+ 55.37,15.32 55.37,25.18 C4.+ | RIGHTSTEPPER.1 74.88,48.13 74.88,43.31 B+.1 74.88,43.09 73.73,41.94 68.68,41.94 V15.2
  Bottom 0.254: VREG2.1 65.93,17.61 57.89,17.61 55.6,15.32 C5.+ | V15.2 68.45,41.71 66.16,39.41 66.16,30.69 VREG1.1 65.93,30.46 62.25,30.46 57.21,25.41 55.6,25.41 C4.+ | C2.+ 54.68,66.72 60.65,66.72 61.11,67.18 71.67,67.18 74.19,64.66 76.03,64.66 76.71,63.97 76.71,55.48 75.8,54.56 73.96,54.56 73.27,53.87 73.27,49.97 74.88,48.36 RIGHTSTEPPER.1
VCC  (via drill 0.61)
  Top 0.254: 40.91,40.1 40.91,39.41 40.45,38.95 39.99,38.95 IC1.4 | 40.91,40.1 40.45,40.56 39.99,40.56 IC1.6 | v41.83,40.1 40.91,40.1 | VREG1.3 65.93,25.41 60.65,25.41 59.5,26.56 46.42,26.56 45.27,25.41 C3.+ | 60.42,56.63 60.42,55.48 62.03,53.87 62.03,53.41 RIGHTSTEPPER.11 | 60.42,56.63 62.03,58.23 RIGHTSTEPPER.13 62.25,58.46 62.25,58.92 64.09,60.76 64.09,63.74 62.94,64.89 60.65,64.89 59.96,65.58 55.37,65.58 54.91,65.12 47.11,65.12 R2.2 46.88,64.89 42.06,64.89 R1.2 41.83,64.89 30.58,64.89 26.68,60.99 LEFTSTEPPER.11 | OC2B.2 49.63,50.66 49.63,45.84 LIGHTSENSE.2 49.4,45.61 47.11,43.31 47.11,40.79 ICSP1.2 | 60.42,56.63 53.76,56.63 52.62,57.77 51.47,57.77 49.63,55.94 PING.2 | ADC1.2 9.01,15.32 13.83,15.32 ADC2.2 | ADC3.2 19.11,15.32 23.93,15.32 ADC6.2 | 9.47,34.36 11.31,34.36 5V2.2 11.54,34.36 14.06,34.36 16.81,37.12 21.4,37.12 28.06,43.77 | 9.47,34.36 6.49,34.36 5V1.2 | PD7.2 29.44,24.04 34.26,24.04 ADC7.2 | PB0.2 3.96,24.04 8.78,24.04 PB1.2 9.01,24.04 10.85,24.04 | PB7.2 23.93,24.04 19.11,24.04 PB6.2 | 10.85,24.04 13.83,24.04 PB2.2 | 9.47,34.36 9.47,28.63 10.85,27.25 10.85,24.04 | IC1.20 31.27,39.87 31.96,39.87 32.42,40.33 32.42,41.02 32.19,41.25 31.27,41.25 IC1.18 31.04,41.48 30.35,41.48 28.06,43.77 | 28.06,43.77 24.85,46.99 24.85,54.1 26.45,55.71 LEFTSTEPPER.13
  Bottom 0.254: 45.73,40.1 46.42,40.1 46.88,40.56 ICSP1.2 | 45.73,40.1 v41.83,40.1 | 45.73,40.1 45.73,37.58 47.34,35.97 47.34,34.82 45.27,32.76 45.27,25.41 C3.+ | RIGHTSTEPPER.7 74.88,63.28 67.08,63.28 62.25,58.46 RIGHTSTEPPER.13 | 46.88,53.18 47.11,53.18 49.4,50.89 OC2B.2 | 46.88,53.18 39.3,53.18 37.01,50.89 SERVO.2 | 46.88,53.18 49.4,55.71 PING.2 | ADC2.2 14.06,15.32 18.88,15.32 ADC3.2 | PB2.2 14.06,24.04 18.88,24.04 PB6.2 | PD7.2 29.21,24.04 24.16,24.04 PB7.2 | ADC1.2 9.01,15.32 10.85,17.15 10.85,22.2 9.01,24.04 PB1.2 | 25.99,55.71 21.17,50.89 14.06,50.89 LEFTSTEPPER.7 | 25.99,55.71 26.45,55.71 LEFTSTEPPER.13 25.99,55.71 | 25.99,55.71 24.85,56.86 24.85,58.69 26.45,60.3 26.45,60.76 LEFTSTEPPER.11
VCC2
  Top 0.254: C6.+ 45.27,15.09 47.11,15.09 49.4,12.79 65.93,12.79 VREG2.3
  Bottom 0.254: 5V3.2 16.58,34.36 21.4,34.36 5V4.2 21.63,34.36 29.89,34.36 30.12,34.59 | 30.12,34.59 35.63,40.1 35.63,46.76 33.11,49.28 33.11,52.04 36.78,55.71 LED.2 | 30.12,34.59 45.04,19.68 45.04,15.32 C6.+

### Text on the board
tNames: 1B | 1B | Robot Brain